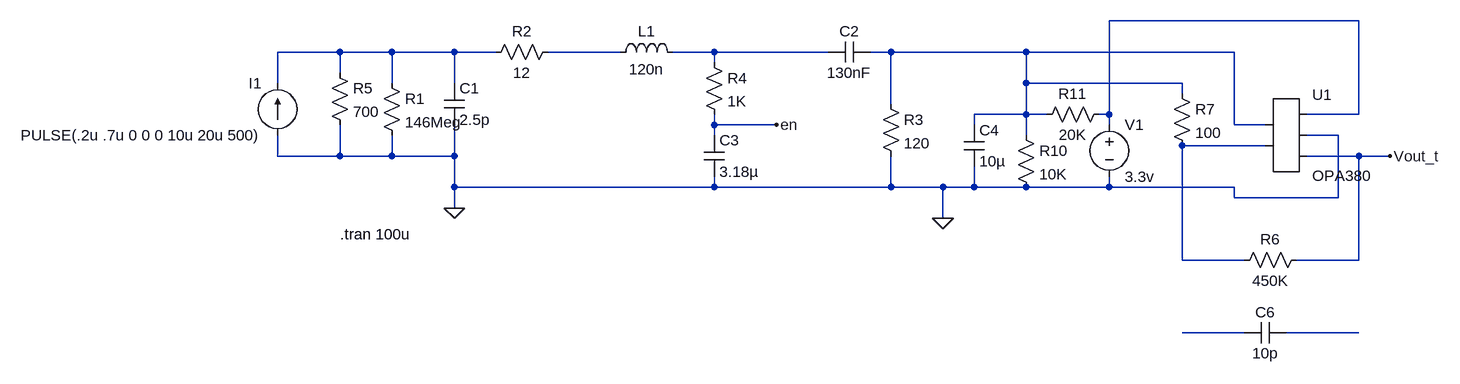
[diagram p0: schematic Draft7.asc]
Draft7.asc, the LTspice schematic file:
Version 4
SHEET 1 1792 680
WIRE 960 112 576 112
WIRE -608 160 -704 160
WIRE -528 160 -608 160
WIRE -432 160 -528 160
WIRE -368 160 -432 160
WIRE -176 160 -288 160
WIRE -32 160 -96 160
WIRE 144 160 -32 160
WIRE 240 160 208 160
WIRE 448 160 240 160
WIRE 768 160 448 160
WIRE -32 176 -32 160
WIRE -608 192 -608 160
WIRE -704 208 -704 160
WIRE -528 208 -528 160
WIRE -432 208 -432 160
WIRE 448 208 448 160
WIRE 688 208 448 208
WIRE 688 224 688 208
WIRE 240 240 240 160
WIRE 448 256 448 208
WIRE 448 256 368 256
WIRE 480 256 448 256
WIRE 576 256 576 112
WIRE 576 256 560 256
WIRE 960 256 960 112
WIRE 960 256 880 256
WIRE -32 272 -32 256
WIRE 64 272 -32 272
WIRE 368 272 368 256
WIRE 576 272 576 256
WIRE 768 272 768 160
WIRE 816 272 768 272
WIRE -32 288 -32 272
WIRE 448 288 448 256
WIRE 928 288 880 288
WIRE 816 304 688 304
WIRE -704 320 -704 288
WIRE -608 320 -608 272
WIRE -608 320 -704 320
WIRE -528 320 -528 288
WIRE -528 320 -608 320
WIRE -432 320 -432 272
WIRE -432 320 -528 320
WIRE 960 320 880 320
WIRE 1008 320 960 320
WIRE -432 368 -432 320
WIRE -32 368 -32 352
WIRE -32 368 -432 368
WIRE 240 368 240 320
WIRE 240 368 -32 368
WIRE 320 368 240 368
WIRE 368 368 368 336
WIRE 368 368 320 368
WIRE 448 368 368 368
WIRE 576 368 576 352
WIRE 576 368 448 368
WIRE 768 368 576 368
WIRE 768 384 768 368
WIRE 928 384 928 288
WIRE 928 384 768 384
WIRE -432 400 -432 368
WIRE 320 416 320 368
WIRE 688 480 688 304
WIRE 784 480 688 480
WIRE 960 480 960 320
WIRE 960 480 864 480
WIRE 784 592 688 592
WIRE 960 592 848 592
FLAG -432 400 0
FLAG 320 416 0
FLAG 64 272 en
FLAG 1008 320 Vout_t
SYMBOL res -544 192 R0
SYMATTR InstName R1
SYMATTR Value 146Meg
SYMBOL cap -448 208 R0
SYMATTR InstName C1
SYMATTR Value 2.5p
SYMBOL res -272 144 R90
WINDOW 0 0 56 VBottom 2
WINDOW 3 32 56 VTop 2
SYMATTR InstName R2
SYMATTR Value 12
SYMBOL current -704 288 R180
WINDOW 3 24 0 Left 2
WINDOW 0 24 80 Left 2
SYMATTR Value PULSE(.2u .7u 0 0 0 10u 20u 500)
SYMATTR InstName I1
SYMATTR Value2 AC .5u 0
SYMBOL Cap 208 144 R90
WINDOW 0 0 32 VBottom 2
WINDOW 3 32 32 VTop 2
SYMATTR InstName C2
SYMATTR Value 130nF
SYMBOL ind -192 176 R270
WINDOW 0 32 56 VTop 2
WINDOW 3 5 56 VBottom 2
SYMATTR InstName L1
SYMATTR Value 120n
SYMBOL Res 224 224 R0
SYMATTR InstName R3
SYMATTR Value 120
SYMBOL voltage 576 256 R0
SYMATTR InstName V1
SYMATTR Value 3.3v
SYMBOL AutoGenerated/OPA380 848 288 R0
SYMATTR InstName U1
SYMBOL Res -48 160 R0
SYMATTR InstName R4
SYMATTR Value 1K
SYMBOL Cap -48 288 R0
SYMATTR InstName C3
SYMATTR Value 3.18µ
SYMBOL Res -624 176 R0
SYMATTR InstName R5
SYMATTR Value 700
SYMBOL Res 880 464 R90
WINDOW 0 0 56 VBottom 2
WINDOW 3 32 56 VTop 2
SYMATTR InstName R6
SYMATTR Value 450K
SYMBOL Res 432 272 R0
SYMATTR InstName R10
SYMATTR Value 10K
SYMBOL Res 576 240 R90
WINDOW 0 0 56 VBottom 2
WINDOW 3 32 56 VTop 2
SYMATTR InstName R11
SYMATTR Value 20K
SYMBOL Cap 352 272 R0
SYMATTR InstName C4
SYMATTR Value 10µ
SYMBOL Res 672 208 R0
SYMATTR InstName R7
SYMATTR Value 100
SYMBOL Cap 848 576 R90
WINDOW 0 0 32 VBottom 2
WINDOW 3 32 32 VTop 2
SYMATTR InstName C6
SYMATTR Value 10p
TEXT -608 440 Left 2 !.tran 100u

The netlist it stands for:
* Draft7.asc
R1 N002 0 146Meg
C1 N002 0 2.5p
R2 N003 N002 12
I1 0 N002 PULSE(.2u .7u 0 0 0 10u 20u 500) AC .5u 0
C2 N005 N004 130nF
L1 N003 N004 120n
R3 N005 0 120
V1 N001 0 3.3v
* U1: OPA380 (symbol AutoGenerated/OPA380 not available, pins judged from their places): pin1=N005 pin2=N006 pin3=N001 pin4=0 pin5=Vout_t
R4 N004 en 1K
C3 en 0 3.18µ
R5 N002 0 700
R6 Vout_t N006 450K
R10 N005 0 10K
R11 N001 N005 20K
C4 N005 0 10µ
R7 N005 N006 100
C6 N008 N007 10p
.tran 100u
.backanno
.end